# Altium schematic sheet Controller.SchDoc: PCB_Personal_Gift
size A4; Author: Ravi kumar dusi; DrawnBy: Ravi dusi; Engineer: Ravi dusi; SheetNumber: 1; SheetTotal: 4
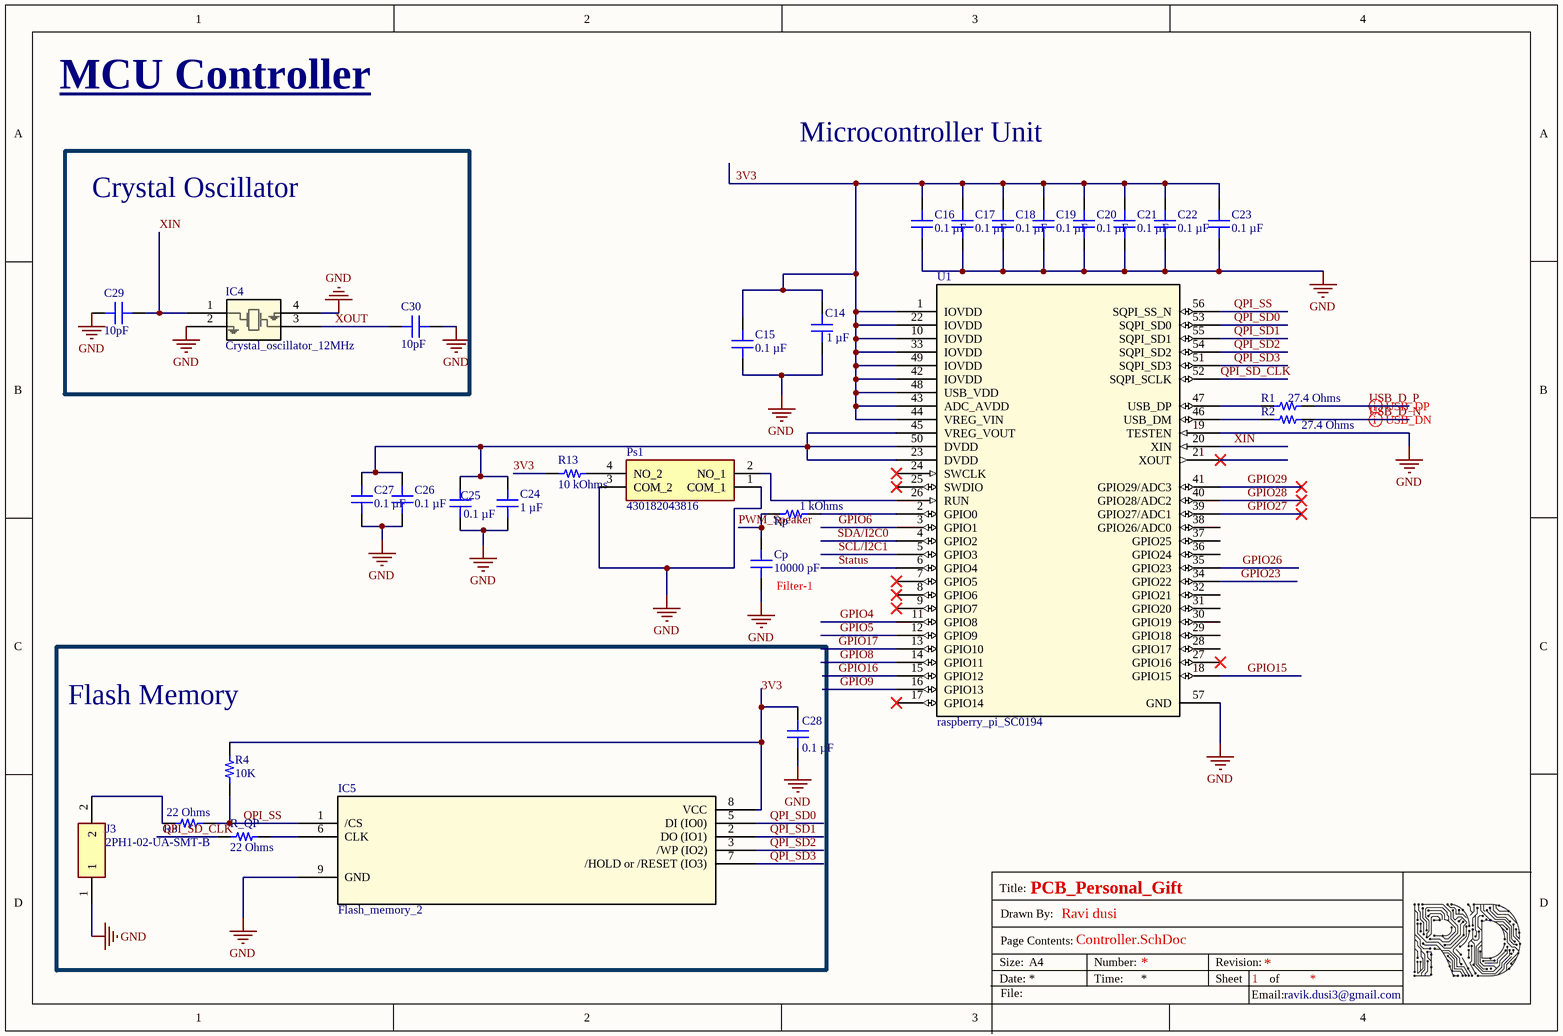
[diagram p0: Controller.SchDoc]

## Parts
C14  1 µF  [CAP 0402_1005]
C15  0.1 µF  [CAP 0402_1005]
C16  0.1 µF  [CAP 0402_1005]
C17  0.1 µF  [CAP 0402_1005]
C18  0.1 µF  [CAP 0402_1005]
C19  0.1 µF  [CAP 0402_1005]
C20  0.1 µF  [CAP 0402_1005]
C21  0.1 µF  [CAP 0402_1005]
C22  0.1 µF  [CAP 0402_1005]
C23  0.1 µF  [CAP 0402_1005]
C24  1 µF  [CAP 0402_1005]
C25  0.1 µF  [CAP 0402_1005]
C26  0.1 µF  [CAP 0402_1005]
C27  0.1 µF  [CAP 0402_1005]
C28  0.1 µF  [CAP 0402_1005]
C29  10pF  [CAP 0402_1005]
C30  10pF  [CAP 0402_1005]
Cp  10000 pF  [CAP 0402_1005]
IC4  Crystal_oscillator_12MHz  [ABM8-272-T3_ABR]
IC5  Flash_memory_2  [SON127P610X510X80-8N430X340]
J3  2PH1-02-UA-SMT-B  [2PH102UASMTB]
Ps1  430182043816  [430182043816]
R1  27.4 Ohms  [RES 0402_1005]
R2  27.4 Ohms  [RES 0402_1005]
R3  22 Ohms  [RES 0402_1005]
R4  10K  [RES 0402_1005]
R13  10 kOhms  [RES 0402_1005]
R_QP  22 Ohms  [RES 0402_1005]
Rp  1 kOhms  [YAGEO RES 0402_1005]
U1  raspberry_pi_SC0194  [QFN56_7X7_RPI]

## Blocks framed on the sheet
Crystal Oscillator: C29 C30 IC4
Flash Memory: C28 IC5 J3 R3 R4 R_QP

## Nets
GND: C14.1 C15.1 C16.1 C17.1 C18.1 C19.1 C20.1 C21.1 C22.1 C23.1 C24.1 C25.1 C26.1 C27.1 C28.1 C29.1 C30.2 Cp.1 IC4.2 IC4.4 IC5.9(GND) J3.1 Ps1.1(COM_1) Ps1.3(COM_2) U1.19(TESTEN) U1.57(GND)
3V3: C14.2 C15.2 C16.2 C17.2 C18.2 C19.2 C20.2 C21.2 C22.2 C23.2 C28.2 IC5.8(VCC) R4.2 R13.1 U1.1(IOVDD) U1.10(IOVDD) U1.22(IOVDD) U1.33(IOVDD) U1.42(IOVDD) U1.43(ADC_AVDD) U1.44(VREG_VIN) U1.48(USB_VDD) U1.49(IOVDD)
GPIO4: U1.11(GPIO8)
GPIO5: U1.12(GPIO9)
GPIO6: U1.3(GPIO1)
GPIO8: U1.14(GPIO11)
GPIO9: U1.16(GPIO13)
GPIO15: U1.18(GPIO15)
GPIO16: U1.15(GPIO12)
GPIO17: U1.13(GPIO10)
GPIO23: U1.34(GPIO22)
GPIO26: U1.35(GPIO23)
GPIO27: U1.39(GPIO27/ADC1)
GPIO28: U1.40(GPIO28/ADC2)
GPIO29: U1.41(GPIO29/ADC3)
PWM_Speaker: Cp.2 Rp.1
QPI_SD0: IC5.5(DI_(IO0)) U1.53(SQPI_SD0)
QPI_SD1: IC5.2(DO_(IO1)) U1.55(SQPI_SD1)
QPI_SD2: IC5.3(/WP_(IO2)) U1.54(SQPI_SD2)
QPI_SD3: IC5.7(/HOLD_or_/RESET_(IO3)) U1.51(SQPI_SD3)
QPI_SD_CLK: R_QP.1 U1.52(SQPI_SCLK)
QPI_SS: IC5.1(/CS) R3.2 R4.1 U1.56(SQPI_SS_N)
SCL/I2C1: U1.5(GPIO3)
SDA/I2C0: U1.4(GPIO2)
Status: U1.6(GPIO4)
USB_D_N: R2.2
USB_D_P: R1.2
XIN: C29.2 IC4.1 U1.20(XIN)
XOUT: C30.1 IC4.3
NetC24_2: C24.2 C25.2 C26.2 C27.2 U1.23(DVDD) U1.45(VREG_VOUT) U1.50(DVDD)
NetIC5_6: IC5.6(CLK) R_QP.2
NetJ3_2: J3.2 R3.1
NetPs1_2: Ps1.2(NO_1) U1.26(RUN)
NetPs1_4: Ps1.4(NO_2) R13.2
NetR1_1: R1.1 U1.47(USB_DP)
NetR2_1: R2.1 U1.46(USB_DM)
NetRp_2: Rp.2 U1.2(GPIO0)

Not connected (* = marked no-connect by the designer): U1 7(GPIO5)* 8(GPIO6)* 9(GPIO7)* 17(GPIO14)* 21(XOUT)* 24(SWCLK)* 25(SWDIO)* 27(GPIO16)* 28(GPIO17) 29(GPIO18) 30(GPIO19) 31(GPIO20) 32(GPIO21) 36(GPIO24) 37(GPIO25) 38(GPIO26/ADC0)

## Layout directives
differential pair: USB_D_N, USB_D_P

## Notes on the sheet
- MCU Controller
- Microcontroller Unit
- (near Cp) Filter-1
- Title:
- Drawn By:
- Size:
- Date:
- File:
- Page Contents:
- A4
- Number:
- Time:
- Revision:
- Sheet
- Email:
- of
- ravik.dusi3@gmail.com

## Library data of the parts
C14 C24 = GRM155C71A105KE11D: CAP CER 1UF 10V X7S 0402; manufacturer: Murata Electronics; Tolerance: ±10%; Part Number: GRM155C71A105KE11D; Value: 1 µF; Applications: General Purpose; Capacitance: 1 µF; componentlink1description: Datasheet; componentlink1url: https://search.murata.co.jp/Ceramy/image/img/A01X/G101/ENG/GRM155C71A105KE11-01.pdf; componentlink2description: DigiKey Link; componentlink2url: https://www.digikey.com/en/products/detail/murata-electronics/GRM155C71A105KE11D/6606086; Device Package: 0402 (1005 Metric); lastupdated: 09/02/2024 20:04:38; Lifecycle Status: Active; Minimum Order: 1; Mounting Type: Surface Mount, MLCC; Operating Temperature: -55°C ~ 125°C; Package / Case: 0402 (1005 Metric); packaging: TapeAndReel; partid: 1749; Part Status: Active; price: 0.01; series: GRM; Size / Dimension: 0.039" L x 0.020" W (1.00mm x 0.50mm); Supplier 1: DigiKey; Supplier Part Number 1: 490-14457-1-ND; Temperature Coefficient: X7S; Thickness (Max): 0.024" (0.60mm); Voltage - Rated: 10V
C15-C23 C25-C28 = C0402C104K4RECAUTO: CAP CER 0402 0.1UF 16V X7R 10%; manufacturer: KEMET; Part Number: C0402C104K4RECAUTO; Value: 0.1 µF; Applications: Automotive, ESD Protection; Capacitance: 0.1 µF; componentlink1description: Datasheet; componentlink1url: https://api.kemet.com/component-edge/download/datasheet/C0402C104K4RECAUTO.pdf; componentlink2description: DigiKey Link; componentlink2url: https://www.digikey.com/en/products/detail/kemet/C0402C104K4RECAUTO/8563695; Device Package: 0402 (1005 Metric); lastupdated: 09/02/2024 20:04:38; Lifecycle Status: Active; Minimum Order: 1; Mounting Type: Surface Mount, MLCC; Operating Temperature: -55°C ~ 125°C; Package / Case: 0402 (1005 Metric); packaging: TapeAndReel; partid: 1731; Part Status: Active; price: 0.01; Ratings: AEC-Q200; series: ESD SMD Auto X7R; Size / Dimension: 0.039" L x 0.020" W (1.00mm x 0.50mm); Supplier 1: DigiKey; Supplier Part Number 1: 399-17167-1-ND; Temperature Coefficient: X7R; Thickness (Max): 0.022" (0.55mm); Tolerance: ±10%; Voltage - Rated: 16V
C29 C30 = 04025U100JAT2A: CAP CER 10PF 50V C0G/NP0 0402; manufacturer: AVX Corporation; Temperature Coefficient: C0G, NP0; Tolerance: ±5%; Part Number: 04025U100JAT2A; Value: 10pF; Applications: RF, Microwave, High Frequency; Capacitance: 10pF; componentlink1description: Datasheet; componentlink1url: http://datasheets.avx.com/U-Series.pdf; componentlink2description: DigiKey Link; componentlink2url: http://digikey.com/product-detail/en/avx-corporation/04025U100JAT2A/478-3831-1-ND/1118493; Device Package: 0402 (1005 Metric); Features: Ultra Low ESR; lastupdated: 08/02/2022 12:26:58; Lifecycle Status: Active; Minimum Order: 1; Mounting Type: Surface Mount, MLCC; Operating Temperature: -55°C ~ 125°C; Package / Case: 0402 (1005 Metric); packaging: TapeAndReel; partid: 1802; Part Status: Active; price: 0.02; series: U; Size / Dimension: 0.039" L x 0.020" W (1.00mm x 0.50mm); Supplier 1: DigiKey; Supplier Part Number 1: 478-3831-1-ND; Thickness (Max): 0.024" (0.60mm); Voltage - Rated: 50V
Cp = C0402C103M5RECAUTO: CAP CER 0402 10NF 50V X7R 20%; manufacturer: KEMET; Part Number: C0402C103M5RECAUTO; Capacitance: 10000 pF; Applications: Automotive, ESD Protection; componentlink1description: Datasheet; componentlink1url: https://api.kemet.com/component-edge/download/datasheet/C0402C103M5RECAUTO.pdf; componentlink2description: DigiKey Link; componentlink2url: https://www.digikey.com/en/products/detail/kemet/C0402C103M5RECAUTO/8646509; Device Package: 0402 (1005 Metric); lastupdated: 09-02-2024 20:04:13; Lifecycle Status: Active; Minimum Order: 1; Mounting Type: Surface Mount, MLCC; Operating Temperature: -55°C ~ 125°C; Package / Case: 0402 (1005 Metric); packaging: TapeAndReel; partid: 33125; Part Status: Active; price: 0.01; Ratings: AEC-Q200; series: ESD SMD Auto X7R; Size / Dimension: 0.039" L x 0.020" W (1.00mm x 0.50mm); Supplier 1: DigiKey; Supplier Part Number 1: 399-C0402C103M5RECAUTOCT-ND; Temperature Coefficient: X7R; Thickness (Max): 0.022" (0.55mm); Tolerance: ±20%; value: 10000 pF; Voltage - Rated: 50V
IC5 = Flash_memory_2: FLASH - NOR Memory IC 128Mb (16M x 8) SPI - Quad I/O, QPI, DTR 133 MHz 8-SOIC
J3 = 2PH1-02-UA-SMT-B: Connector; Manufacturer_Name: Adam Tech; Datasheet Link: https://datasheet.datasheetarchive.com/originals/distributors/Datasheets_SAMA/9f680ad2dadff3b0200287e04b69ceab.pdf; Height: 6.7mm; Manufacturer_Part_Number: 2PH1-02-UA-SMT-B; Mouser Part Number: 737-2PH1-02-UA-SMT-B; Mouser Price/Stock: https://www.mouser.co.uk/ProductDetail/Adam-Tech/2PH1-02-UA-SMT-B?qs=HoCaDK9Nz5ctaJuvgnyAoA%3D%3D; Arrow Part Number: 2PH1-02-UA-SMT-B; Arrow Price/Stock: https://www.arrow.com/en/products/2ph1-02-ua-smt-b/adam-tech?utm_currency=USD&region=nac
Ps1 = 430182043816: Switch; Manufacturer_Name: Wurth Elektronik; Datasheet Link: https://www.we-online.com/catalog/datasheet/430182043816.pdf; Height: 4.3mm; Manufacturer_Part_Number: 430182043816; Mouser Part Number: 710-430182043816; Mouser Price/Stock: https://www.mouser.co.uk/ProductDetail/Wurth-Elektronik/430182043816?qs=wr8lucFkNMVm%252BwK7rSM84A%3D%3D
R1 R2 = RC0402FR-0727R4L: RES 27.4 OHM 1% 1/16W 0402; Manufacturer: Yageo; Power (Watts): 0.063W, 1/16W; Temperature Coefficient: ±100ppm/°C; Part Number: RC0402FR-0727R4L; Value: 27.4 Ohms; ComponentLink1Description: Datasheet; ComponentLink1URL: https://www.yageo.com/upload/media/product/productsearch/datasheet/rchip/PYu-RC_Group_51_RoHS_L_10.pdf; ComponentLink2Description: DigiKey Link; ComponentLink2URL: https://www.digikey.com/en/products/detail/yageo/RC0402FR-0727R4L/5280945; Composition: Thick Film; Device Package: 0402 (1005 Metric); Features: Moisture Resistant; Height - Seated (Max): 0.016" (0.40mm); LastUpdated: 09/02/2024 20:30:23; Lifecycle Status: Active; Minimum Order: 1; Number of Terminations: 2; Operating Temperature: -55°C ~ 155°C; Package / Case: 0402 (1005 Metric); Packaging: CutTape; PartId: 2632; Part Status: Active; Price: 0.01; Resistance: 27.4 Ohms; Series: RC_L; Size / Dimension: 0.039" L x 0.020" W (1.00mm x 0.50mm); Supplier 1: DigiKey; Supplier Part Number 1: YAG3085CT-ND; Supplier Device Package: 0402; Tolerance: ±1%
R3 R_QP = RR0510R-220-D: RES SMD 22 OHM 0.5% 1/16W 0402; Manufacturer: Susumu; Power (Watts): 0.063W, 1/16W; Temperature Coefficient: ±100ppm/°C; Part Number: RR0510R-220-D; Value: 22 Ohms; ComponentLink1Description: Datasheet; ComponentLink1URL: http://www.susumu.co.jp/common/pdf/n_catalog_partition05_en.pdf; ComponentLink2Description: DigiKey Link; ComponentLink2URL: https://www.digikey.com/en/products/detail/susumu/RR0510R-220-D/567231; Composition: Thin Film; Device Package: 0402 (1005 Metric); Height - Seated (Max): 0.016" (0.40mm); LastUpdated: 09-02-2024 20:30:21; Lifecycle Status: Active; Minimum Order: 1; Number of Terminations: 2; Operating Temperature: -55°C ~ 125°C; Package / Case: 0402 (1005 Metric); Packaging: TapeAndReel; PartId: 3266; Part Status: Active; Price: 0.01; Resistance: 22 Ohms; Series: RR; Size / Dimension: 0.039" L x 0.020" W (1.00mm x 0.50mm); Supplier 1: DigiKey; Supplier Part Number 1: RR05R22DCT-ND; Tolerance: ±0.5%
R4 = RP73PF1E10KBTD: RES 10K OHM 0.1% 1/10W 0402; Manufacturer: TE Connectivity Passive Product; Power (Watts): 0.1W, 1/10W; Resistance: 10 kOhms; Temperature Coefficient: ±25ppm/°C; Part Number: RP73PF1E10KBTD; Value: 10K; ComponentLink1Description: Datasheet; ComponentLink1URL: https://www.te.com/commerce/DocumentDelivery/DDEController?Action=srchrtrv&DocNm=1773272&DocType=DS&DocLang=English; ComponentLink2Description: DigiKey Link; ComponentLink2URL: https://www.digikey.com/en/products/detail/te-connectivity-passive-product/RP73PF1E10KBTD/8260957; Composition: Thin Film; Device Package: 0402 (1005 Metric); Height - Seated (Max): 0.014" (0.35mm); LastUpdated: 09/02/2024 20:30:24; Lifecycle Status: Active; Minimum Order: 1; Number of Terminations: 2; Operating Temperature: -55°C ~ 155°C; Package / Case: 0402 (1005 Metric); Packaging: TapeAndReel; PartId: 2434; Part Status: Active; Price: 0.08; Series: RP73, Holsworthy; Size / Dimension: 0.039" L x 0.020" W (1.00mm x 0.50mm); Supplier 1: DigiKey; Supplier Part Number 1: A127415CT-ND; Supplier Device Package: 0402; Tolerance: ±0.1%
R13 = RP73PF1E10KBTD: RES 10K OHM 0.1% 1/10W 0402; Manufacturer: TE Connectivity Passive Product; Power (Watts): 0.1W, 1/10W; Temperature Coefficient: ±25ppm/°C; Part Number: RP73PF1E10KBTD; Value: 10 kOhms; ComponentLink1Description: Datasheet; ComponentLink1URL: https://www.te.com/commerce/DocumentDelivery/DDEController?Action=srchrtrv&DocNm=1773272&DocType=DS&DocLang=English; ComponentLink2Description: DigiKey Link; ComponentLink2URL: https://www.digikey.com/en/products/detail/te-connectivity-passive-product/RP73PF1E10KBTD/8260957; Composition: Thin Film; Device Package: 0402 (1005 Metric); Height - Seated (Max): 0.014" (0.35mm); LastUpdated: 09/02/2024 20:30:24; Lifecycle Status: Active; Minimum Order: 1; Number of Terminations: 2; Operating Temperature: -55°C ~ 155°C; Package / Case: 0402 (1005 Metric); Packaging: TapeAndReel; PartId: 2434; Part Status: Active; Price: 0.08; Resistance: 10 kOhms; Series: RP73, Holsworthy; Size / Dimension: 0.039" L x 0.020" W (1.00mm x 0.50mm); Supplier 1: DigiKey; Supplier Part Number 1: A127415CT-ND; Supplier Device Package: 0402; Tolerance: ±0.1%
Rp = AT0402BRD071KL: RES SMD 1K OHM 0.1% 1/16W 0402; Manufacturer: Yageo; Power (Watts): 0.063W, 1/16W; Temperature Coefficient: ±25ppm/°C; Part Number: AT0402BRD071KL; Value: 1 kOhms; ComponentLink1Description: Datasheet; ComponentLink1URL: http://www.yageo.com/documents/recent/PYu-AT_51_RoHS_L_5.pdf; ComponentLink2Description: DigiKey Link; ComponentLink2URL: https://www.digikey.com/en/products/detail/yageo/AT0402BRD071KL/5138607; Composition: Thin Film; Device Package: 0402 (1005 Metric); Features: Anti-Sulfur, Automotive AEC-Q200, Moisture Resistant; Height - Seated (Max): 0.014" (0.35mm); LastUpdated: 31-08-2025 15:04:18; Lifecycle Status: Active; Minimum Order: 1; Number of Terminations: 2; Operating Temperature: -55°C ~ 155°C; Package / Case: 0402 (1005 Metric); Packaging: TapeAndReel; PartId: 2462; Part Status: Active; Price: 0.09; Ratings: AEC-Q200; Resistance: 1 kOhms; Series: AT; Size / Dimension: 0.039" L x 0.020" W (1.00mm x 0.50mm); Supplier 1: DigiKey; Supplier Part Number 1: YAG2088CT-ND; Supplier Device Package: 0402; Tolerance: ±0.1%
U1 = raspberry_pi_SC0194: rp2040 rapberri Pi Microcontroller